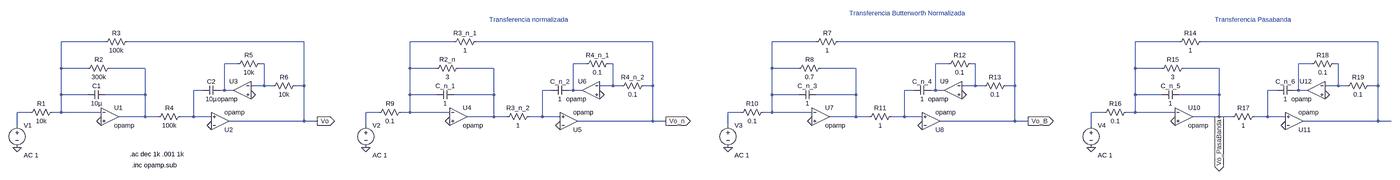
[diagram p0: schematic TS2.asc, whole sheet]
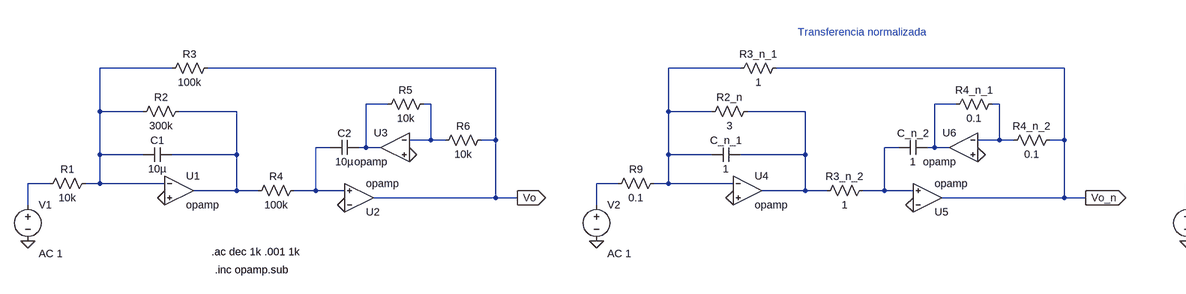
[diagram p1: schematic TS2.asc, part, row 1 of 1, column 1 of 2]
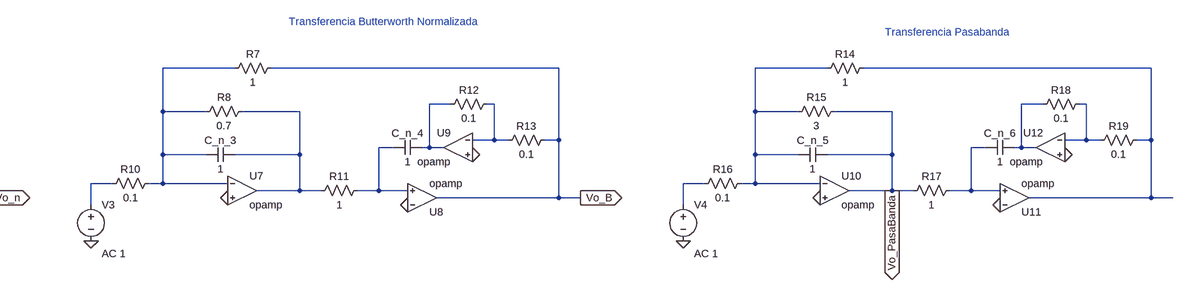
[diagram p2: schematic TS2.asc, part, row 1 of 1, column 2 of 2]
TS2.asc, the LTspice schematic file:
Version 4
SHEET 1 2760 688
WIRE -2336 160 -2496 160
WIRE -1616 160 -2256 160
WIRE -1072 160 -1232 160
WIRE -352 160 -992 160
WIRE 256 160 96 160
WIRE 976 160 336 160
WIRE 1584 160 1424 160
WIRE 2304 160 1664 160
WIRE -1856 240 -1904 240
WIRE -1760 240 -1776 240
WIRE -592 240 -640 240
WIRE -496 240 -512 240
WIRE 736 240 688 240
WIRE 832 240 816 240
WIRE 2064 240 2016 240
WIRE 2160 240 2144 240
WIRE -2496 256 -2496 160
WIRE -2400 256 -2496 256
WIRE -2192 256 -2320 256
WIRE -1232 256 -1232 160
WIRE -1136 256 -1232 256
WIRE -928 256 -1056 256
WIRE 96 256 96 160
WIRE 192 256 96 256
WIRE 400 256 272 256
WIRE 1424 256 1424 160
WIRE 1520 256 1424 256
WIRE 1728 256 1600 256
WIRE -1760 320 -1760 240
WIRE -1760 320 -1808 320
WIRE -1728 320 -1760 320
WIRE -1616 320 -1616 160
WIRE -1616 320 -1648 320
WIRE -496 320 -496 240
WIRE -496 320 -544 320
WIRE -464 320 -496 320
WIRE -352 320 -352 160
WIRE -352 320 -384 320
WIRE 832 320 832 240
WIRE 832 320 784 320
WIRE 864 320 832 320
WIRE 976 320 976 160
WIRE 976 320 944 320
WIRE 2160 320 2160 240
WIRE 2160 320 2112 320
WIRE 2192 320 2160 320
WIRE 2304 320 2304 160
WIRE 2304 320 2272 320
WIRE -1984 336 -2016 336
WIRE -1904 336 -1904 240
WIRE -1904 336 -1920 336
WIRE -1872 336 -1904 336
WIRE -720 336 -752 336
WIRE -640 336 -640 240
WIRE -640 336 -656 336
WIRE -608 336 -640 336
WIRE 608 336 576 336
WIRE 688 336 688 240
WIRE 688 336 672 336
WIRE 720 336 688 336
WIRE 1936 336 1904 336
WIRE 2016 336 2016 240
WIRE 2016 336 2000 336
WIRE 2048 336 2016 336
WIRE -2496 352 -2496 256
WIRE -2400 352 -2496 352
WIRE -2192 352 -2192 256
WIRE -2192 352 -2336 352
WIRE -1232 352 -1232 256
WIRE -1136 352 -1232 352
WIRE -928 352 -928 256
WIRE -928 352 -1072 352
WIRE 96 352 96 256
WIRE 192 352 96 352
WIRE 400 352 400 256
WIRE 400 352 256 352
WIRE 1424 352 1424 256
WIRE 1520 352 1424 352
WIRE 1728 352 1728 256
WIRE 1728 352 1584 352
WIRE -2608 416 -2656 416
WIRE -2496 416 -2496 352
WIRE -2496 416 -2528 416
WIRE -2352 416 -2496 416
WIRE -1344 416 -1392 416
WIRE -1232 416 -1232 352
WIRE -1232 416 -1264 416
WIRE -1088 416 -1232 416
WIRE -16 416 -64 416
WIRE 96 416 96 352
WIRE 96 416 64 416
WIRE 240 416 96 416
WIRE 1312 416 1264 416
WIRE 1424 416 1424 352
WIRE 1424 416 1392 416
WIRE 1568 416 1424 416
WIRE -2192 432 -2192 352
WIRE -2192 432 -2288 432
WIRE -2144 432 -2192 432
WIRE -2016 432 -2016 336
WIRE -2016 432 -2064 432
WIRE -1952 432 -2016 432
WIRE -928 432 -928 352
WIRE -928 432 -1024 432
WIRE -880 432 -928 432
WIRE -752 432 -752 336
WIRE -752 432 -800 432
WIRE -688 432 -752 432
WIRE 400 432 400 352
WIRE 400 432 304 432
WIRE 448 432 400 432
WIRE 576 432 576 336
WIRE 576 432 528 432
WIRE 640 432 576 432
WIRE 1728 432 1728 352
WIRE 1728 432 1632 432
WIRE 1776 432 1728 432
WIRE 1904 432 1904 336
WIRE 1904 432 1856 432
WIRE 1968 432 1904 432
WIRE -1616 448 -1616 320
WIRE -1616 448 -1888 448
WIRE -1568 448 -1616 448
WIRE -352 448 -352 320
WIRE -352 448 -624 448
WIRE -304 448 -352 448
WIRE 976 448 976 320
WIRE 976 448 704 448
WIRE 1024 448 976 448
WIRE 2304 448 2304 320
WIRE 2304 448 2032 448
WIRE 2352 448 2304 448
WIRE -2656 464 -2656 416
WIRE -1392 464 -1392 416
WIRE -64 464 -64 416
WIRE 1264 464 1264 416
FLAG -2352 448 0
FLAG -1952 464 0
FLAG -1808 352 0
FLAG -2656 544 0
FLAG -1568 448 Vo
IOPIN -1568 448 Out
FLAG -1088 448 0
FLAG -688 464 0
FLAG -544 352 0
FLAG -1392 544 0
FLAG -304 448 Vo_n
IOPIN -304 448 Out
FLAG 240 448 0
FLAG 640 464 0
FLAG 784 352 0
FLAG -64 544 0
FLAG 1024 448 Vo_B
IOPIN 1024 448 Out
FLAG 1568 448 0
FLAG 1968 464 0
FLAG 2112 352 0
FLAG 1264 544 0
FLAG 1728 432 Vo_PasaBanda
IOPIN 1728 432 Out
SYMBOL res -2240 144 R90
WINDOW 0 0 56 VBottom 2
WINDOW 3 32 56 VTop 2
SYMATTR InstName R3
SYMATTR Value 100k
SYMBOL res -2304 240 R90
WINDOW 0 0 56 VBottom 2
WINDOW 3 32 56 VTop 2
SYMATTR InstName R2
SYMATTR Value 300k
SYMBOL cap -2336 336 R90
WINDOW 0 0 32 VBottom 2
WINDOW 3 32 32 VTop 2
SYMATTR InstName C1
SYMATTR Value 10µ
SYMBOL OpAmps\\opamp -2320 368 R0
SYMATTR InstName U1
SYMBOL res -2512 400 R90
WINDOW 0 0 56 VBottom 2
WINDOW 3 32 56 VTop 2
SYMATTR InstName R1
SYMATTR Value 10k
SYMBOL res -2048 416 R90
WINDOW 0 0 56 VBottom 2
WINDOW 3 32 56 VTop 2
SYMATTR InstName R4
SYMATTR Value 100k
SYMBOL OpAmps\\opamp -1920 512 M180
SYMATTR InstName U2
SYMBOL cap -1920 320 R90
WINDOW 0 0 32 VBottom 2
WINDOW 3 32 32 VTop 2
SYMATTR InstName C2
SYMATTR Value 10µ
SYMBOL OpAmps\\opamp -1840 272 M0
SYMATTR InstName U3
SYMBOL res -1760 224 R90
WINDOW 0 0 56 VBottom 2
WINDOW 3 32 56 VTop 2
SYMATTR InstName R5
SYMATTR Value 10k
SYMBOL res -1632 304 R90
WINDOW 0 0 56 VBottom 2
WINDOW 3 32 56 VTop 2
SYMATTR InstName R6
SYMATTR Value 10k
SYMBOL voltage -2656 448 R0
WINDOW 123 24 124 Left 2
WINDOW 39 0 0 Left 0
SYMATTR InstName V1
SYMATTR Value ""
SYMATTR Value2 AC 1
SYMBOL res -976 144 R90
WINDOW 0 0 56 VBottom 2
WINDOW 3 32 56 VTop 2
SYMATTR InstName R3_n_1
SYMATTR Value 1
SYMBOL res -1040 240 R90
WINDOW 0 0 56 VBottom 2
WINDOW 3 32 56 VTop 2
SYMATTR InstName R2_n
SYMATTR Value 3
SYMBOL cap -1072 336 R90
WINDOW 0 0 32 VBottom 2
WINDOW 3 32 32 VTop 2
SYMATTR InstName C_n_1
SYMATTR Value 1
SYMBOL OpAmps\\opamp -1056 368 R0
SYMATTR InstName U4
SYMBOL res -1248 400 R90
WINDOW 0 0 56 VBottom 2
WINDOW 3 32 56 VTop 2
SYMATTR InstName R9
SYMATTR Value 0.1
SYMBOL res -784 416 R90
WINDOW 0 0 56 VBottom 2
WINDOW 3 32 56 VTop 2
SYMATTR InstName R3_n_2
SYMATTR Value 1
SYMBOL OpAmps\\opamp -656 512 M180
SYMATTR InstName U5
SYMBOL cap -656 320 R90
WINDOW 0 0 32 VBottom 2
WINDOW 3 32 32 VTop 2
SYMATTR InstName C_n_2
SYMATTR Value 1
SYMBOL OpAmps\\opamp -576 272 M0
SYMATTR InstName U6
SYMBOL res -496 224 R90
WINDOW 0 0 56 VBottom 2
WINDOW 3 32 56 VTop 2
SYMATTR InstName R4_n_1
SYMATTR Value 0.1
SYMBOL res -368 304 R90
WINDOW 0 0 56 VBottom 2
WINDOW 3 32 56 VTop 2
SYMATTR InstName R4_n_2
SYMATTR Value 0.1
SYMBOL voltage -1392 448 R0
WINDOW 123 24 124 Left 2
WINDOW 39 0 0 Left 0
SYMATTR InstName V2
SYMATTR Value ""
SYMATTR Value2 AC 1
SYMBOL res 352 144 R90
WINDOW 0 0 56 VBottom 2
WINDOW 3 32 56 VTop 2
SYMATTR InstName R7
SYMATTR Value 1
SYMBOL res 288 240 R90
WINDOW 0 0 56 VBottom 2
WINDOW 3 32 56 VTop 2
SYMATTR InstName R8
SYMATTR Value 0.7
SYMBOL cap 256 336 R90
WINDOW 0 0 32 VBottom 2
WINDOW 3 32 32 VTop 2
SYMATTR InstName C_n_3
SYMATTR Value 1
SYMBOL OpAmps\\opamp 272 368 R0
SYMATTR InstName U7
SYMBOL res 80 400 R90
WINDOW 0 0 56 VBottom 2
WINDOW 3 32 56 VTop 2
SYMATTR InstName R10
SYMATTR Value 0.1
SYMBOL res 544 416 R90
WINDOW 0 0 56 VBottom 2
WINDOW 3 32 56 VTop 2
SYMATTR InstName R11
SYMATTR Value 1
SYMBOL OpAmps\\opamp 672 512 M180
SYMATTR InstName U8
SYMBOL cap 672 320 R90
WINDOW 0 0 32 VBottom 2
WINDOW 3 32 32 VTop 2
SYMATTR InstName C_n_4
SYMATTR Value 1
SYMBOL OpAmps\\opamp 752 272 M0
SYMATTR InstName U9
SYMBOL res 832 224 R90
WINDOW 0 0 56 VBottom 2
WINDOW 3 32 56 VTop 2
SYMATTR InstName R12
SYMATTR Value 0.1
SYMBOL res 960 304 R90
WINDOW 0 0 56 VBottom 2
WINDOW 3 32 56 VTop 2
SYMATTR InstName R13
SYMATTR Value 0.1
SYMBOL voltage -64 448 R0
WINDOW 123 24 124 Left 2
WINDOW 39 0 0 Left 0
SYMATTR InstName V3
SYMATTR Value ""
SYMATTR Value2 AC 1
SYMBOL res 1680 144 R90
WINDOW 0 0 56 VBottom 2
WINDOW 3 32 56 VTop 2
SYMATTR InstName R14
SYMATTR Value 1
SYMBOL res 1616 240 R90
WINDOW 0 0 56 VBottom 2
WINDOW 3 32 56 VTop 2
SYMATTR InstName R15
SYMATTR Value 3
SYMBOL cap 1584 336 R90
WINDOW 0 0 32 VBottom 2
WINDOW 3 32 32 VTop 2
SYMATTR InstName C_n_5
SYMATTR Value 1
SYMBOL OpAmps\\opamp 1600 368 R0
SYMATTR InstName U10
SYMBOL res 1408 400 R90
WINDOW 0 0 56 VBottom 2
WINDOW 3 32 56 VTop 2
SYMATTR InstName R16
SYMATTR Value 0.1
SYMBOL res 1872 416 R90
WINDOW 0 0 56 VBottom 2
WINDOW 3 32 56 VTop 2
SYMATTR InstName R17
SYMATTR Value 1
SYMBOL OpAmps\\opamp 2000 512 M180
SYMATTR InstName U11
SYMBOL cap 2000 320 R90
WINDOW 0 0 32 VBottom 2
WINDOW 3 32 32 VTop 2
SYMATTR InstName C_n_6
SYMATTR Value 1
SYMBOL OpAmps\\opamp 2080 272 M0
SYMATTR InstName U12
SYMBOL res 2160 224 R90
WINDOW 0 0 56 VBottom 2
WINDOW 3 32 56 VTop 2
SYMATTR InstName R18
SYMATTR Value 0.1
SYMBOL res 2288 304 R90
WINDOW 0 0 56 VBottom 2
WINDOW 3 32 56 VTop 2
SYMATTR InstName R19
SYMATTR Value 0.1
SYMBOL voltage 1264 448 R0
WINDOW 123 24 124 Left 2
WINDOW 39 0 0 Left 0
SYMATTR InstName V4
SYMATTR Value ""
SYMATTR Value2 AC 1
TEXT -2248 568 Left 2 !.ac dec 1k .001 1k
TEXT -2240 608 Left 2 !.inc opamp.sub
TEXT -944 80 Left 2 ;Transferencia normalizada
TEXT 376 56 Left 2 ;Transferencia Butterworth Normalizada
TEXT 1712 80 Left 2 ;Transferencia Pasabanda

The netlist it stands for:
* TS2.asc
R3 Vo N001 100k
R2 N014 N001 300k
C1 N014 N001 10µ
XU1 N001 0 N014 opamp Aol=100K GBW=10Meg  ; pins invin noninvin out
R1 N001 N021 10k
R4 N017 N014 100k
XU2 0 N017 Vo opamp Aol=100K GBW=10Meg  ; pins invin noninvin out
C2 N006 N017 10µ
XU3 N007 0 N006 opamp Aol=100K GBW=10Meg  ; pins invin noninvin out
R5 N007 N006 10k
R6 Vo N007 10k
V1 N021 0 AC 1
R3_n_1 Vo_n N002 1
R2_n N015 N002 3
C_n_1 N015 N002 1
XU4 N002 0 N015 opamp Aol=100K GBW=10Meg  ; pins invin noninvin out
R9 N002 N022 0.1
R3_n_2 N018 N015 1
XU5 0 N018 Vo_n opamp Aol=100K GBW=10Meg  ; pins invin noninvin out
C_n_2 N008 N018 1
XU6 N009 0 N008 opamp Aol=100K GBW=10Meg  ; pins invin noninvin out
R4_n_1 N009 N008 0.1
R4_n_2 Vo_n N009 0.1
V2 N022 0 AC 1
R7 Vo_B N003 1
R8 N016 N003 0.7
C_n_3 N016 N003 1
XU7 N003 0 N016 opamp Aol=100K GBW=10Meg  ; pins invin noninvin out
R10 N003 N023 0.1
R11 N019 N016 1
XU8 0 N019 Vo_B opamp Aol=100K GBW=10Meg  ; pins invin noninvin out
C_n_4 N010 N019 1
XU9 N011 0 N010 opamp Aol=100K GBW=10Meg  ; pins invin noninvin out
R12 N011 N010 0.1
R13 Vo_B N011 0.1
V3 N023 0 AC 1
R14 N005 N004 1
R15 Vo_PasaBanda N004 3
C_n_5 Vo_PasaBanda N004 1
XU10 N004 0 Vo_PasaBanda opamp Aol=100K GBW=10Meg  ; pins invin noninvin out
R16 N004 N024 0.1
R17 N020 Vo_PasaBanda 1
XU11 0 N020 N005 opamp Aol=100K GBW=10Meg  ; pins invin noninvin out
C_n_6 N012 N020 1
XU12 N013 0 N012 opamp Aol=100K GBW=10Meg  ; pins invin noninvin out
R18 N013 N012 0.1
R19 N005 N013 0.1
V4 N024 0 AC 1
.ac dec 1k .001 1k
.inc opamp.sub
* Transferencia normalizada
* Transferencia Butterworth Normalizada
* Transferencia Pasabanda
.backanno
.end